# EAGLE board PX4FMUlite_V0_4 (EAGLE 6.5.0)
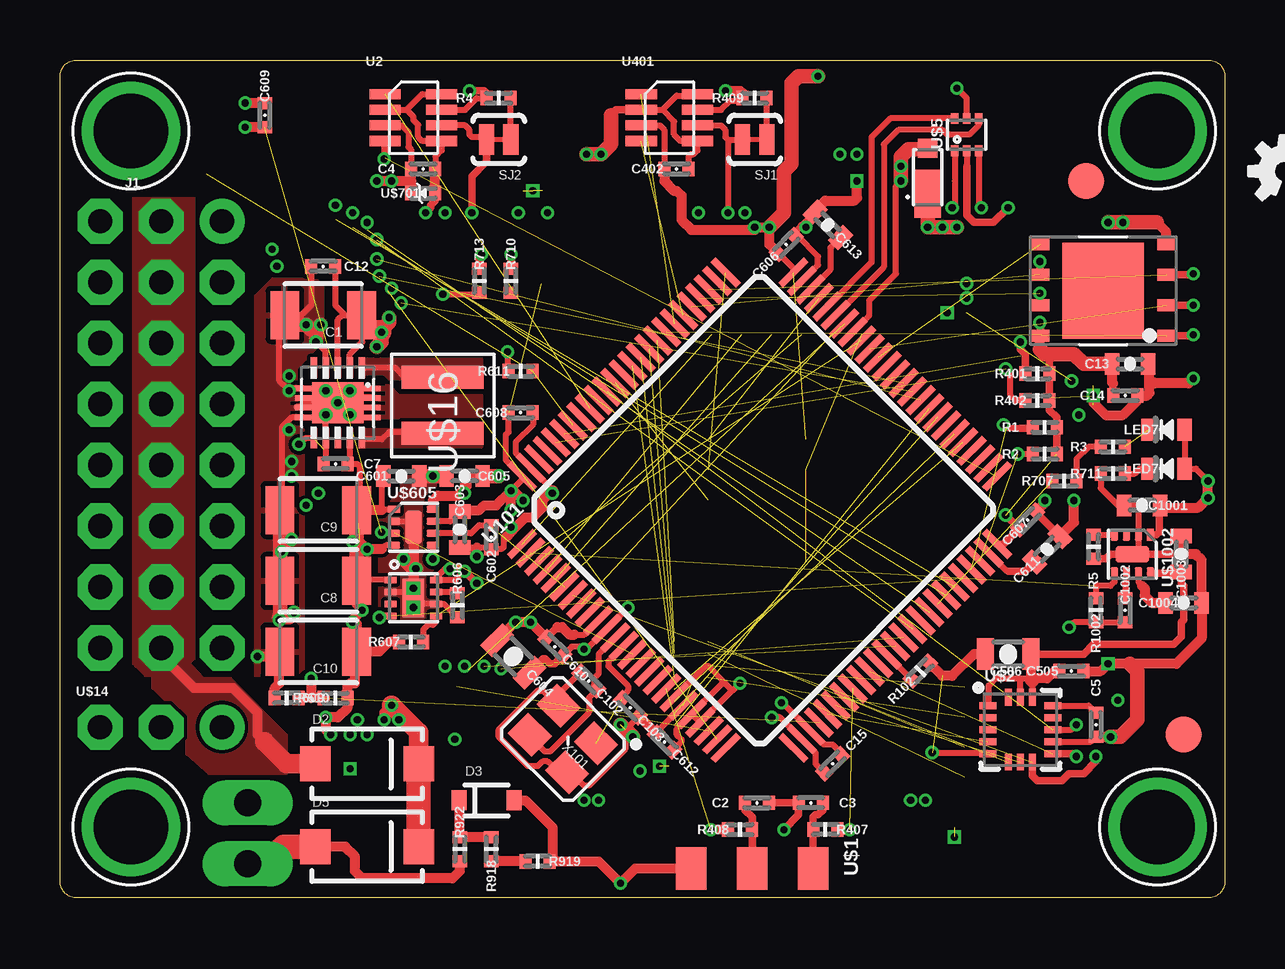
[diagram p12: board, top side]
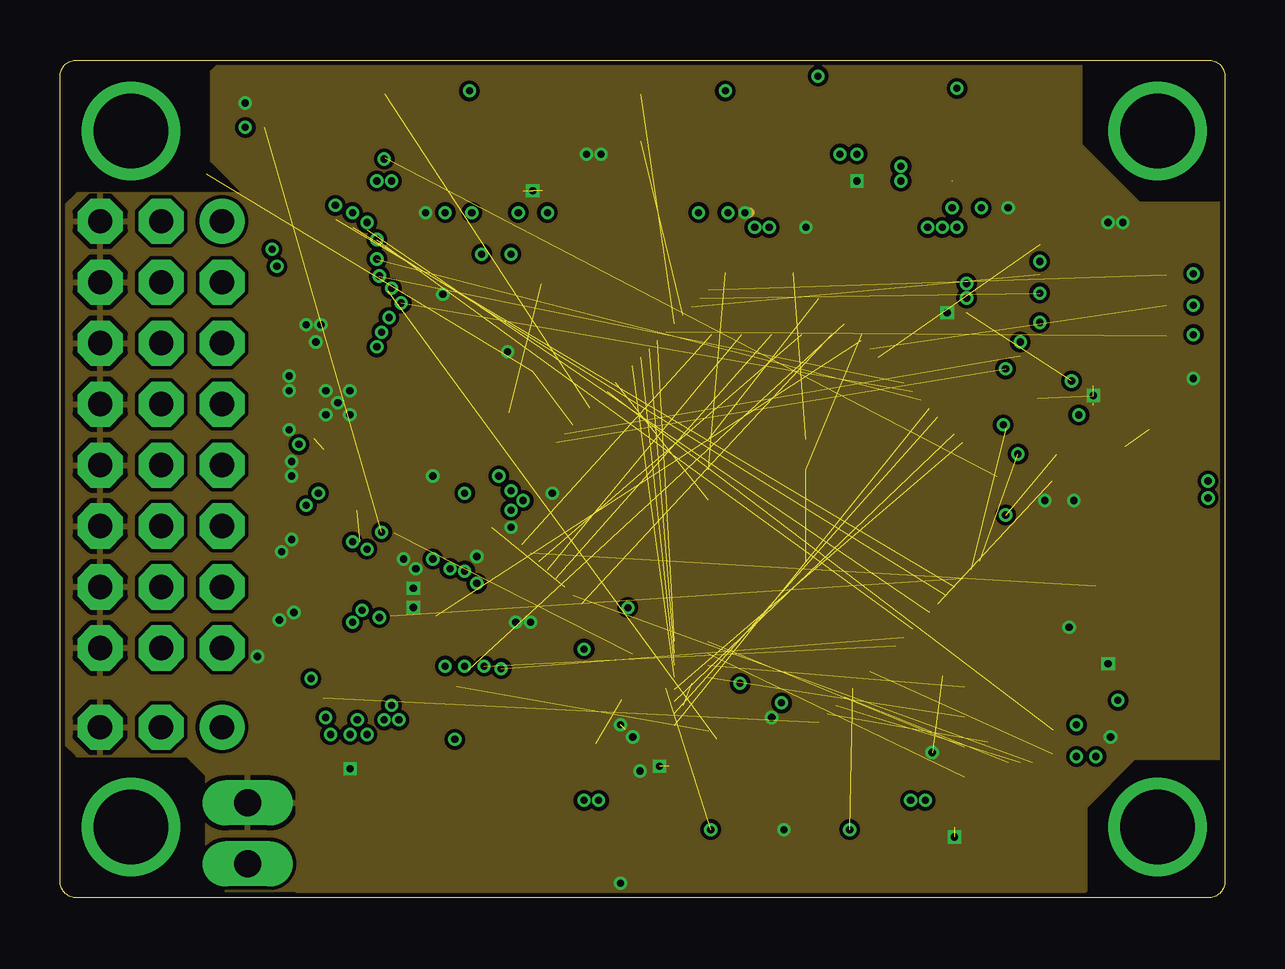
[diagram p13: board, inner layer Ground]
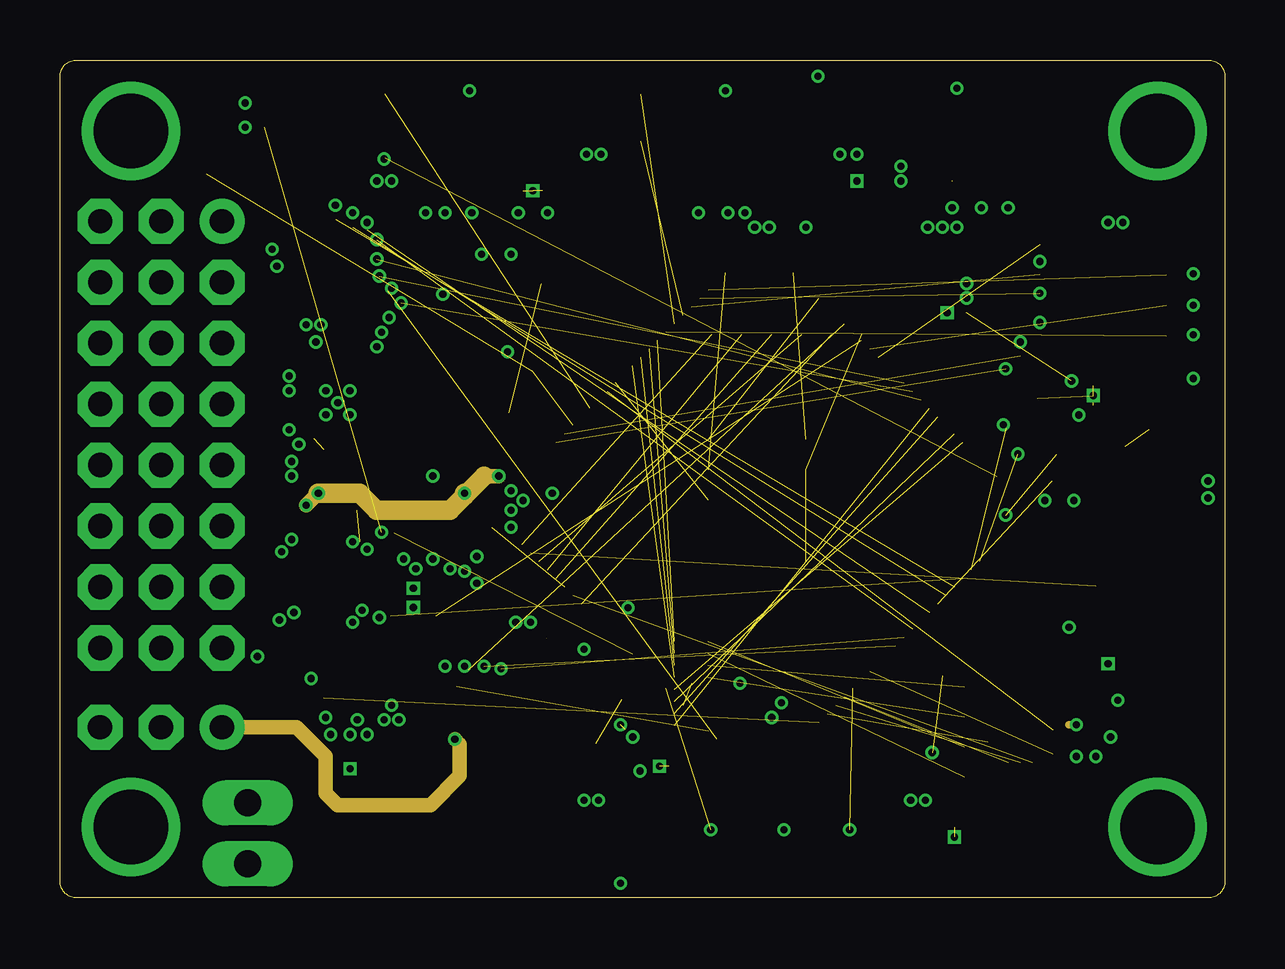
[diagram p14: board, inner layer Horizontal]
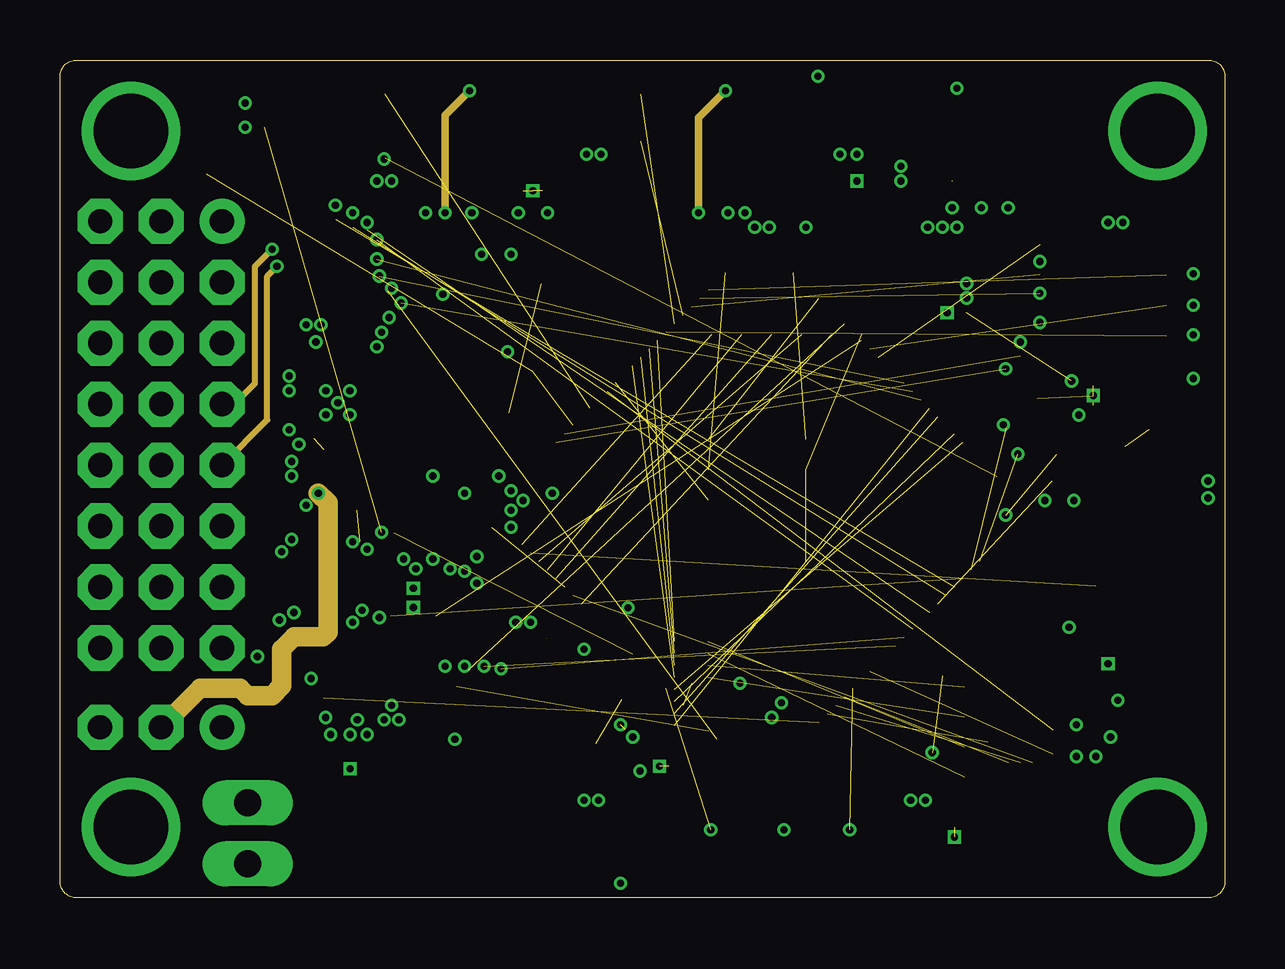
[diagram p15: board, inner layer Vertical]
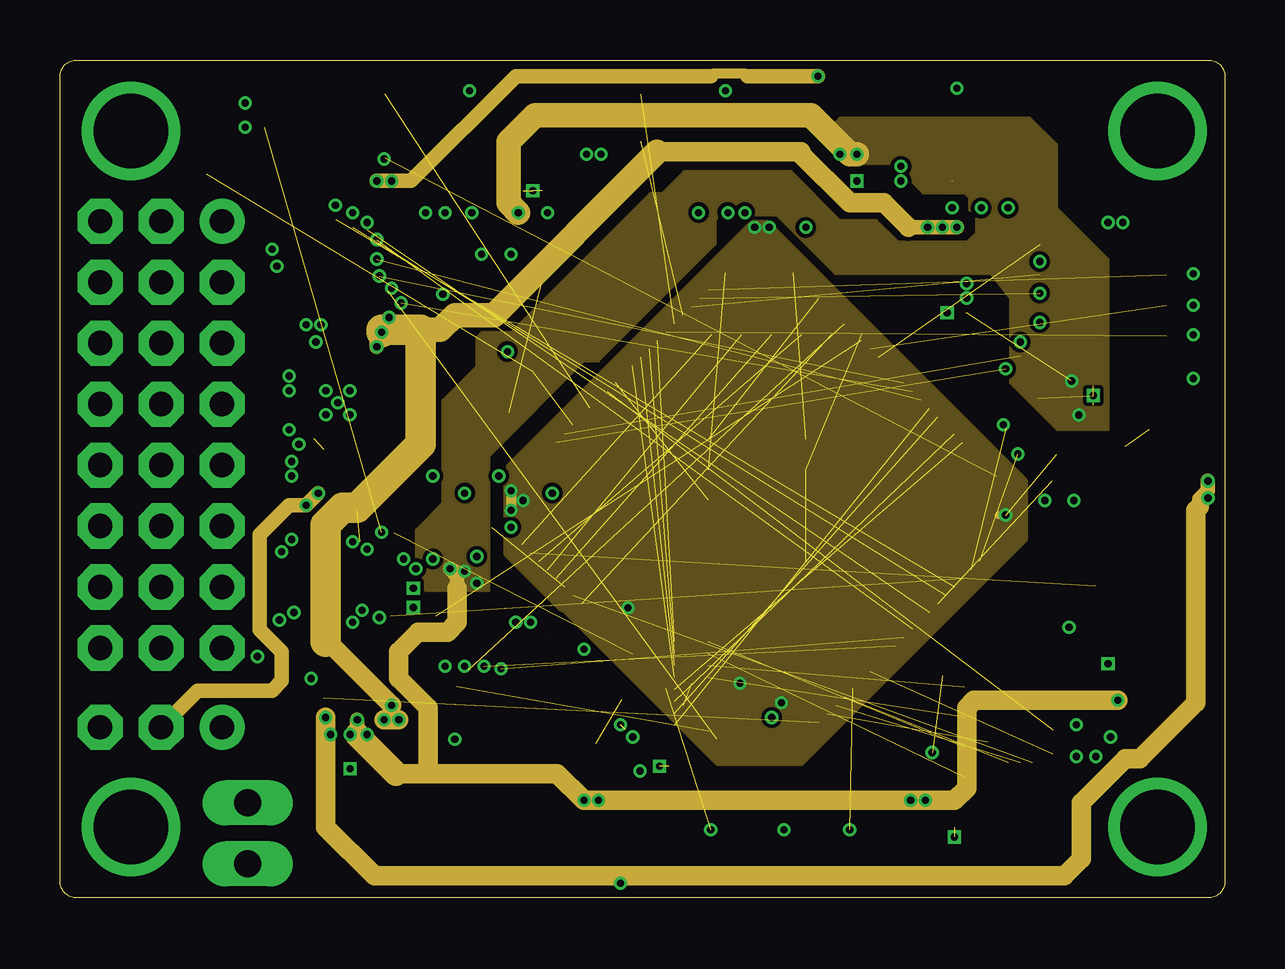
[diagram p16: board, inner layer Power]
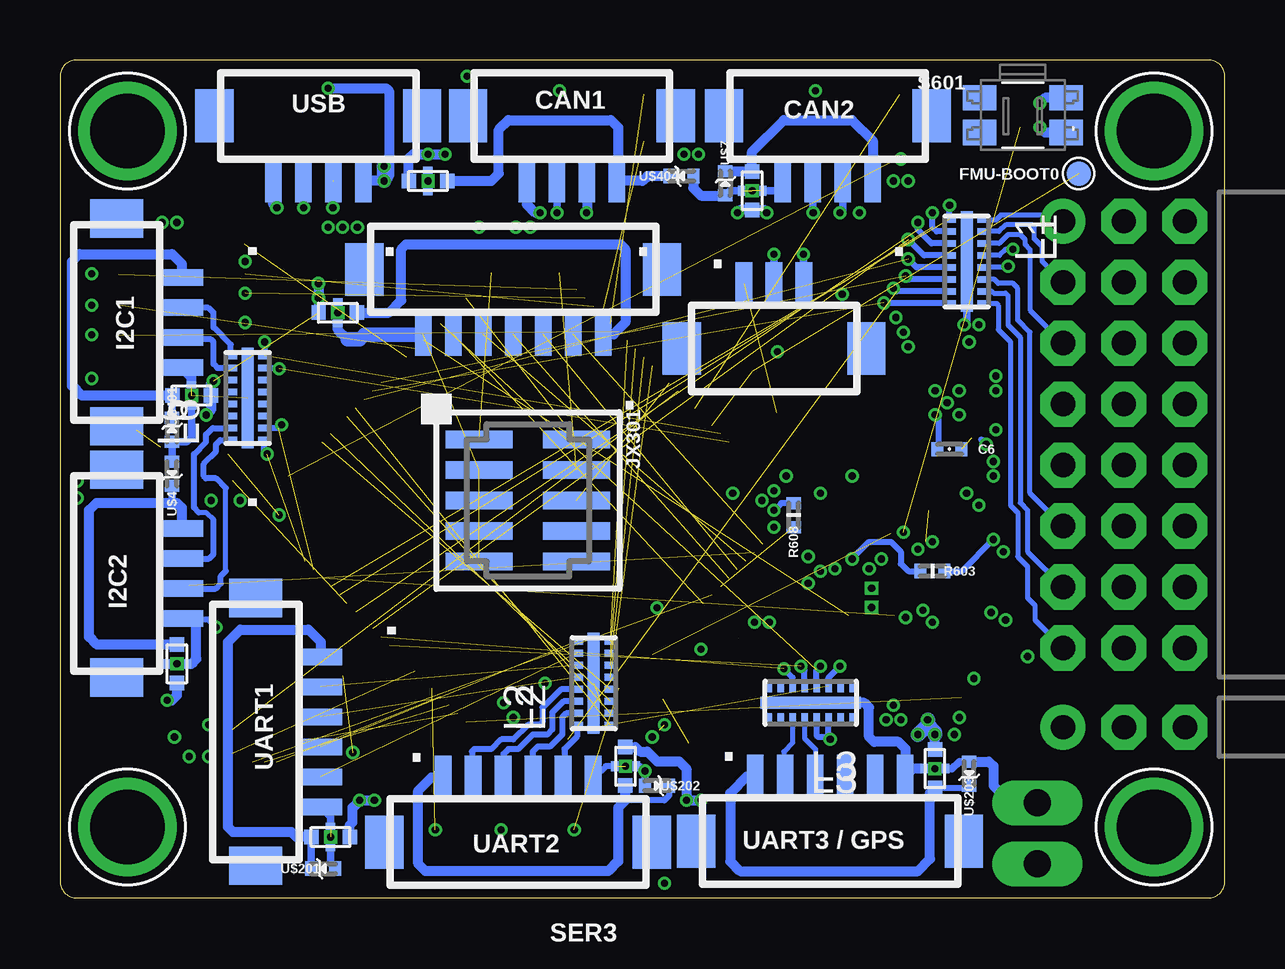
[diagram p17: board, bottom side, seen from below]

Size 48.56 x 34.91 mm. Coordinates in mm from the lower left corner, seen from the top.
Outline: 0,0.7 0,34.21 arc-90 0.7,34.91 47.86,34.91 arc-90 48.56,34.21 48.56,0.7 arc-90 47.86,0 0.7,0 arc-90 0,0.7
Copper layers (1*2*3*14*15*16): Top 0.035mm / dielectric 0.5mm / Ground 0.035mm / dielectric 0.15mm / Horizontal 0.035mm / dielectric 0.15mm / Vertical 0.035mm / dielectric 0.15mm / Power 0.035mm / dielectric 0.5mm / Bottom 0.035mm
Design rules "default *": minimum track width 0.2mm, minimum drill 0.3mm, track to track 0.15mm, track to pad 0.15mm, pad to pad 0.15mm, via to via 0.15mm, smd to smd 0.15mm, copper to edge 0.2mm, drill to drill 0.3mm, minimum pad ring 0.125mm, minimum via ring 0.125mm, stop-mask expansion 1mil, vias tented up to drill 0.31mm, thermal gap 8mil
Net classes: 0 signal: width 0.152 mm, drill 0.2 mm, clearance 0.152 mm; 1 power: width 0.254 mm, drill 0.3 mm, clearance 0.152 mm

## Footprints (pad centres in the part's own frame; a part is rotated, then mirrored left to right if it is on the bottom)
1210 = smd 1.2 x 2: 1 -1.6,0; 2 1.6,0
0402-CAP = smd 0.5 x 0.6: P$1 -0.5,0; P$2 0.5,0
0603-CAP = smd 0.6 x 0.9: P$1 -0.75,0; P$2 0.75,0
0805-CAP = smd 0.7 x 1.3: P$1 -0.95,0; P$2 0.95,0
MICROSMP = smd 0.8 x 0.8: ANODE 0.65,0 | smd 2 x 1.1: CATHODE -1.25,0
SMA-DIODE = smd 1.27 x 1.47: A -2.15,0; C 2.15,0
SOD-323 = smd 0.63 x 0.83: 1 -1.15,0; 2 1.15,0
PAD.04X.04 = smd 1.016 x 1.016: P$1 0,0
3X8RA_SERVO = drill 1.016 pad 1.88 octagon: GND_S1 -3.81,8.89; GND_S2 -3.81,6.35; GND_S3 -3.81,3.81; GND_S4 -3.81,1.27; GND_S5 -3.81,-1.27; GND_S6 -3.81,-3.81; GND_S7 -3.81,-6.35; GND_S8 -3.81,-8.89; PWR_S1 -1.27,8.89; PWR_S2 -1.27,6.35; PWR_S3 -1.27,3.81; PWR_S4 -1.27,1.27; PWR_S5 -1.27,-1.27; PWR_S6 -1.27,-3.81; PWR_S7 -1.27,-6.35; PWR_S8 -1.27,-8.89; S2 1.27,6.35; S3 1.27,3.81; S4 1.27,1.27; S5 1.27,-1.27; S6 1.27,-3.81; S7 1.27,-6.35; S8 1.27,-8.89 | drill 1.016 pad 1.88: S1 1.27,8.89
DF13C-4P-1.25V = smd 1.6 x 2.2: M$0 4.325,-1.8; M$1 -4.325,-1.8 | smd 0.7 x 1.8: P$1 -1.875,0.9; P$2 -0.625,0.9; P$3 0.625,0.9; P$4 1.875,0.9
DF13C-6P-1.25V = smd 1.6 x 2.2: M$0 5.575,-1.8; M$1 -5.575,-1.8 | smd 0.7 x 1.8: P$1 -3.125,0.9; P$2 -1.875,0.9; P$3 -0.625,0.9; P$4 0.625,0.9; P$5 1.875,0.9; P$6 3.125,0.9
DF13C-7P-1.25V = smd 1.6 x 2.2: M$0 6.2,-1.8; M$1 -6.2,-1.8 | smd 0.7 x 1.8: P$1 -3.75,0.9; P$2 -2.5,0.9; P$3 -1.25,0.9; P$4 0,0.9; P$5 1.25,0.9; P$6 2.5,0.9; P$7 3.75,0.9
DF13C-3P-1.25V = smd 1.6 x 2.2: M$0 3.85,-1.8; M$1 -3.85,-1.8 | smd 0.7 x 1.8: P$1 -1.25,0.9; P$2 0,0.9; P$3 1.25,0.9
FIDUCIAL-1.5X3 = smd 1.5 x 1.5: 1 0,0
1X02_LONGPADS = drill 1.118 pad 1.88 long: 1 0,0; 2 2.54,0
FTSH-105-01-XXX-DV-K = smd 0.737 x 2.794: 1 -2.54,-2.032; 2 -2.54,2.032; 3 -1.27,-2.032; 4 -1.27,2.032; 5 0,-2.032; 6 0,2.032; 7 1.27,-2.032; 8 1.27,2.032; 9 2.54,-2.032; 10 2.54,2.032
DFN16-THIN = smd 0.28 x 0.51: P$1 -1.75,-0.7; P$2 -1.25,-0.7; P$3 -0.75,-0.7; P$4 -0.25,-0.7; P$5 0.25,-0.7; P$6 0.75,-0.7; P$7 1.25,-0.7; P$8 1.75,-0.7; P$9 1.75,0.7; P$10 1.25,0.7; P$11 0.75,0.7; P$12 0.25,0.7; P$13 -0.25,0.7; P$14 -0.75,0.7; P$15 -1.25,0.7; P$16 -1.75,0.7 | smd 4.2 x 0.5: P$EP 0,0
KYOCERA-KNH16-DA = smd 0.6 x 0.6: P$1 -0.8,0; P$2 0.8,0 | smd 0.4 x 0.4: P$3 0,-0.4; P$4 0,0.4 | drill 0.3 pad 0.4 square: P$5 0,0
0603-LED = smd 0.6 x 0.9: A 0.75,0; C -0.75,0
MOUNT-HOLE3.1 = drill 3.1 pad 4.1: P$1 0,0
0402-RES = smd 0.5 x 0.6: P$1 -0.5,0; P$2 0.5,0
EVQP7J01K = smd 1.4 x 1.05: A1 -1.8,0.725; A2 1.8,0.725; B3 -1.8,-0.725; B4 1.8,-0.725
SJ_2S-TRACE = smd 0.635 x 1.27: 1 -0.508,0; 2 0.508,0
SOT23-8 = smd 0.42 x 1.3: 1 -0.975,-1.175; 2 -0.325,-1.175; 3 0.325,-1.175; 4 0.975,-1.175; 5 0.975,1.175; 6 0.325,1.175; 7 -0.325,1.175; 8 -0.975,1.175
TQFP100 = smd 1.5 x 0.29: 1 -8,6; 2 -8,5.5; 3 -8,5; 4 -8,4.5; 5 -8,4; 6 -8,3.5; 7 -8,3; 8 -8,2.5; 9 -8,2; 10 -8,1.5; 11 -8,1; 12 -8,0.5; 13 -8,0; 14 -8,-0.5; 15 -8,-1; 16 -8,-1.5; 17 -8,-2; 18 -8,-2.5; 19 -8,-3; 20 -8,-3.5; 21 -8,-4; 22 -8,-4.5; 23 -8,-5; 24 -8,-5.5; 25 -8,-6; 51 8,-6; 52 8,-5.5; 53 8,-5; 54 8,-4.5; 55 8,-4; 56 8,-3.5; 57 8,-3; 58 8,-2.5; 59 8,-2; 60 8,-1.5; 61 8,-1; 62 8,-0.5; 63 8,0; 64 8,0.5; 65 8,1; 66 8,1.5; 67 8,2; 68 8,2.5; 69 8,3; 70 8,3.5; 71 8,4; 72 8,4.5; 73 8,5; 74 8,5.5; 75 8,6 | smd 0.29 x 1.5: 26 -6,-8; 27 -5.5,-8; 28 -5,-8; 29 -4.5,-8; 30 -4,-8; 31 -3.5,-8; 32 -3,-8; 33 -2.5,-8; 34 -2,-8; 35 -1.5,-8; 36 -1,-8; 37 -0.5,-8; 38 0,-8; 39 0.5,-8; 40 1,-8; 41 1.5,-8; 42 2,-8; 43 2.5,-8; 44 3,-8; 45 3.5,-8; 46 4,-8; 47 4.5,-8; 48 5,-8; 49 5.5,-8; 50 6,-8; 76 6,8; 77 5.5,8; 78 5,8; 79 4.5,8; 80 4,8; 81 3.5,8; 82 3,8; 83 2.5,8; 84 2,8; 85 1.5,8; 86 1,8; 87 0.5,8; 88 0,8; 89 -0.5,8; 90 -1,8; 91 -1.5,8; 92 -2,8; 93 -2.5,8; 94 -3,8; 95 -3.5,8; 96 -4,8; 97 -4.5,8; 98 -5,8; 99 -5.5,8; 100 -6,8
HEADER_3X01_SMD_H_BOARD_EDGE_SHORT = smd 1.27 x 1.778: 1 -2.54,0; 2 0,0; 3 2.54,0
16LGA-3X3 = smd 0.7 x 0.3: 1 -1.35,1; 2 -1.35,0.5; 3 -1.35,0; 4 -1.35,-0.5; 5 -1.35,-1; 9 1.35,-1; 10 1.35,-0.5; 11 1.35,0; 12 1.35,0.5; 13 1.35,1 | smd 0.3 x 0.7: 6 -0.5,-1.35; 7 0,-1.35; 8 0.5,-1.35; 14 0.5,1.35; 15 0,1.35; 16 -0.5,1.35
WSON-8-5X6 = smd 0.5 x 0.75: 1 -1.875,-2.625; 2 -0.605,-2.625; 3 0.665,-2.625; 4 1.935,-2.625; 5 1.935,2.625; 6 0.665,2.625; 7 -0.605,2.625; 8 -1.875,2.625 | smd 4 x 3.4: PAD 0,0
0402-TVS = smd 0.5 x 0.6: A 0.5,0; C -0.5,0
SOT563-6 = smd 0.3 x 0.45: 1 -0.5,-0.675; 2 0,-0.675; 3 0.5,-0.675; 4 0.5,0.675; 5 0,0.675; 6 -0.5,0.675
3X1RA = drill 1.016 pad 1.88: 1 5.08,0 | drill 1.016 pad 1.88 octagon: 2 2.54,0; 3 0,0
PWSON10 = smd 0.28 x 0.85: 1 -1,-1.475; 2 -0.5,-1.475; 3 0,-1.475; 4 0.5,-1.475; 5 1,-1.475; 10 1,1.475; 11 0.5,1.475; 12 0,1.475; 13 -0.5,1.475; 14 -1,1.475 | smd 0.7 x 0.23: 6 1.425,-0.6; 7 1.425,-0.2; 8 1.425,0.2; 9 1.425,0.6; 15 -1.425,0.6; 16 -1.425,0.2; 17 -1.425,-0.2; 18 -1.425,-0.6 | drill 0.3 pad 0.406: 19 0.5,0.5; 20 0.5,-0.5; 21 -0.5,-0.5; 22 -0.5,0.5; 23 0,0 | smd 2.15 x 1.7: EP 0,0
XFL4020 = smd 0.965 x 3.404: 1 -1.168,0; 2 1.168,0
QFN8-DSG = smd 0.28 x 0.5: 1 -0.75,-0.95; 2 -0.25,-0.95; 3 0.25,-0.95; 4 0.75,-0.95; 5 0.75,0.95; 6 0.25,0.95; 7 -0.25,0.95; 8 -0.75,0.95 | smd 1.6 x 0.9: GND 0,0 | drill 0.3 square: P$2 -0.4,0; P$3 0.4,0
MLF-8-EPAD = smd 0.5 x 0.3: 1 -0.8,0.75; 2 -0.8,0.25; 3 -0.8,-0.25; 4 -0.8,-0.75; 5 0.8,-0.75; 6 0.8,-0.25; 7 0.8,0.25; 8 0.8,0.75 | smd 0.7 x 1.4: GND 0,0
OSCILLATOR-3.2X2.5 = smd 1.4 x 1.2: 1 -1.1,-0.85; 2 1.1,-0.85; 3 1.1,0.85; 4 -1.1,0.85

## Placement (x,y rotation side)
C1  22uF  [1210]  10.97,24.28 180 top
C2  0u1  [0402-CAP]  29.06,3.96 0 top
C3  0u1  [0402-CAP]  31.29,3.96 180 top
C4  0u1  [0402-CAP]  15.14,30.38 0 top
C5  0u1  [0402-CAP]  43.18,7.21 270 top
C6  0u1  [0402-CAP]  11.48,18.69 180 bottom
C7  0u1  [0402-CAP]  11.48,18.08 180 top
C8  22uF  [1210]  10.77,13.21 180 top
C9  22uF  [1210]  10.77,16.15 180 top
C10  22uF  [1210]  10.77,10.26 180 top
C12  0u1  [0402-CAP]  10.97,26.31 180 top
C13  2u2  [0603-CAP]  44.6,22.25 0 top
C14  0u1  [0402-CAP]  44.4,20.93 0 top
C15  0u1  [0402-CAP]  32.21,5.59 225 top
C102  8p  [0402-CAP]  22.05,9.04 135 top
C103  8p  [0402-CAP]  23.77,7.92 135 top
C402  0u1  [0402-CAP]  25.7,30.38 0 top
C505  10n  [0402-CAP]  42.16,9.45 0 top
C506  10u/10V  [0805-CAP]  39.52,10.16 180 top
C601  2u2  [0603-CAP]  14.22,17.58 0 top
C602  10n  [0402-CAP]  17.98,15.04 90 top
C603  1u0  [0603-CAP]  16.66,15.34 270 top
C604  10u/10V  [0805-CAP]  18.9,10.06 135 top
C605  1u0  [0603-CAP]  16.87,17.58 180 top
C606  0u1  [0402-CAP]  30.28,27.23 45 top
C607  0u1  [0402-CAP]  40.34,15.75 45 top
C608  0u1  [0402-CAP]  19.2,20.22 0 top
C609  0u1  [0402-CAP]  8.53,32.61 270 top
C610  0u1  [0402-CAP]  20.62,10.46 135 top
C611  2u2  [0603-CAP]  41.15,14.53 45 top
C612  0u1  [0402-CAP]  25.2,6.5 135 top
C613  2u2  [0603-CAP]  32,28.04 135 top
C1001  1u0  [0603-CAP]  45.11,16.36 180 top
C1002  10n  [0402-CAP]  44.4,11.99 270 top
C1003  1u0  [0603-CAP]  46.74,14.33 90 top
C1004  1u0  [0603-CAP]  46.84,12.29 0 top
D1  MSS1P4-M3  [MICROSMP]  36.17,30.58 90 top
D2  B340A  [SMA-DIODE]  12.8,5.59 0 top
D3  [SOD-323]  17.78,4.06 0 top
D5  B340A  [SMA-DIODE]  12.8,2.13 0 top
FMU-BOOT0  PAD.04  [PAD.04X.04]  6.1,30.18 0 bottom
J1  [3X8RA_SERVO]  5.49,19.3 0 top
J2  DF13-4P-1.25V  [DF13C-4P-1.25V]  44.4,13.51 270 bottom
J3  DF13C-4P-1.25V  [DF13C-4P-1.25V]  16.56,30.78 180 bottom
J201  DF13C-6P-1.25V  [DF13C-6P-1.25V]  38.6,6.92 270 bottom
J202  DF13C-6P-1.25V  [DF13C-6P-1.25V]  29.47,4.12 0 bottom
J203  DF13C-6P-1.25V  [DF13C-6P-1.25V]  16.46,4.17 0 bottom
J302  DF13C-4P-1.25V  [DF13C-4P-1.25V]  37.8,30.78 180 bottom
J401  DF13C-4P-1.25V  [DF13C-4P-1.25V]  44.4,23.98 270 bottom
J403  DF13C-7P-1.25V  [DF13C-7P-1.25V]  29.67,24.38 180 bottom
J405  DF13C-4P-1.25V  [DF13C-4P-1.25V]  27.23,30.78 180 bottom
J802  DF13C-3P-1.25V  [DF13C-3P-1.25V]  18.8,24.69 0 bottom
JP1  FIDUCIAL1.5X3  [FIDUCIAL-1.5X3]  42.77,29.87 0 top
JP2  FIDUCIAL1.5X3  [FIDUCIAL-1.5X3]  46.84,6.81 0 top
JP5  M02PTH3  [1X02_LONGPADS]  7.82,1.42 90 top
JX301  ARM_MINI_JTAG-SMT  [FTSH-105-01-XXX-DV-K]  29.06,16.56 270 bottom
L1  NUF8402MN  [DFN16-THIN]  10.77,26.52 270 bottom
L2  NUF8402MN  [DFN16-THIN]  26.31,8.94 90 bottom
L3  NUF8402MN  [DFN16-THIN]  17.27,8.13 180 bottom
L4  KNH16C104DA5TS  [KYOCERA-KNH16-DA]  43.08,20.93 180 bottom
L5  KNH16C104DA5TS  [KYOCERA-KNH16-DA]  43.69,9.75 90 bottom
L6  NUF8402MN  [DFN16-THIN]  40.74,20.83 90 bottom
L7  KNH16C104DA5TS  [KYOCERA-KNH16-DA]  19.71,29.46 90 bottom
L201  KNH16C104DA5TS  [KYOCERA-KNH16-DA]  37.29,2.54 180 bottom
L202  KNH16C104DA5TS  [KYOCERA-KNH16-DA]  24.99,5.49 270 bottom
L203  KNH16C104DA5TS  [KYOCERA-KNH16-DA]  12.09,5.38 270 bottom
L402  KNH16C104DA5TS  [KYOCERA-KNH16-DA]  36.98,24.38 0 bottom
L403  KNH16C104DA5TS  [KYOCERA-KNH16-DA]  33.22,29.87 0 bottom
LED701  AMBER  [0603-LED]  46.13,19.51 0 top
LED704  GREEN  [0603-LED]  46.13,17.88 0 top
M3_MOUNT1101  MOUNT-HOLE3.1MM  [MOUNT-HOLE3.1]  2.95,31.96 0 top
M3_MOUNT1102  MOUNT-HOLE3.1MM  [MOUNT-HOLE3.1]  45.75,2.96 0 top
M3_MOUNT1103  MOUNT-HOLE3.1MM  [MOUNT-HOLE3.1]  45.75,31.96 0 top
M3_MOUNT1104  MOUNT-HOLE3.1MM  [MOUNT-HOLE3.1]  2.95,2.96 0 top
OSHW_LOGO  OSHW-LOGOS  [OSHW-LOGO-S]  51.04,30.27 0 top
R1  1K5  [0402-RES]  41.05,19.61 0 top
R2  1K5  [0402-RES]  41.05,18.49 0 top
R3  220R  [0402-RES]  43.89,18.8 0 top
R4  120R  [0402-RES]  18.29,33.32 0 top
R5  10K  [0402-RES]  43.08,14.63 90 top
R102  10K  [0402-RES]  35.86,9.45 45 top
R401  1K5  [0402-RES]  40.74,21.84 0 top
R402  1K5  [0402-RES]  40.74,20.73 0 top
R407  10K/0.1%  [0402-RES]  31.9,2.84 180 top
R408  10K/0.1%  [0402-RES]  28.35,2.84 0 top
R409  120R  [0402-RES]  28.96,33.32 0 top
R603  10K  [0402-RES]  12.19,13.61 180 bottom
R606  25K  [0402-RES]  16.56,12.19 270 top
R607  10K  [0402-RES]  14.63,10.67 0 top
R608  1K  [0402-RES]  17.98,15.95 90 bottom
R609  10K/0.1%  [0402-RES]  11.48,8.33 0 top
R610  10K/0.1%  [0402-RES]  9.45,8.33 180 top
R611  10K  [0402-RES]  19.2,21.95 0 top
R707  220R  [0402-RES]  41.86,17.37 0 top
R710  47R  [0402-RES]  18.8,25.7 270 top
R711  220R  [0402-RES]  43.89,17.68 0 top
R713  1K5  [0402-RES]  17.48,25.7 270 top
R918  10K/0.1%  [0402-RES]  17.98,2.03 90 top
R919  10K/0.1%  [0402-RES]  19.91,1.52 180 top
R922  10K/0.1%  [0402-RES]  16.66,2.03 270 top
R1002  10K  [0402-RES]  43.18,11.99 90 top
S601  RESET  [EVQP7J01K]  8.43,32.61 180 bottom
SJ1  SOLDERJUMPERTRACE  [SJ_2S-TRACE]  28.96,31.6 180 top
SJ2  SOLDERJUMPERTRACE  [SJ_2S-TRACE]  18.29,31.6 180 top
U2  MAX3051  [SOT23-8]  14.73,32.51 270 top
U101  STM32F4X7VX  [TQFP100]  29.16,16.15 45 top
U401  MAX3051  [SOT23-8]  25.4,32.51 270 top
U$1  HEADER-3X1BOARDEDGE-SHORT  [HEADER_3X01_SMD_H_BOARD_EDGE_SHORT]  28.85,1.22 180 top
U$2  MAX21100  [16LGA-3X3]  40.03,7.01 0 top
U$3  W25Q64FV  [WSON-8-5X6]  43.48,25.3 90 top
U$4  PESD0402-140  [0402-TVS]  43.89,17.68 90 bottom
U$5  NUF2042XV6  [SOT563-6]  37.8,31.8 0 top
U$7  PESD0402-140  [0402-TVS]  20.83,29.77 270 bottom
U$14  HEADER-3X1RA  [3X1RA]  1.67,7.11 0 top
U$15  TPS6303X  [PWSON10]  11.58,20.62 180 top
U$16  XFL4020-222MEB  [XFL4020]  15.95,20.52 90 top
U$201  PESD0402-140  [0402-TVS]  37.59,1.22 0 bottom
U$202  PESD0402-140  [0402-TVS]  23.67,4.67 180 bottom
U$203  PESD0402-140  [0402-TVS]  10.67,5.18 90 bottom
U$401  PESD0402-140  [0402-TVS]  43.89,19.51 270 bottom
U$404  PESD0402-140  [0402-TVS]  22.66,30.07 0 bottom
U$604  BQ24315  [QFN8-DSG]  14.73,12.5 270 top
U$605  MIC5332  [MLF-8-EPAD]  14.73,15.44 0 top
U$701  PESD0402-140  [0402-TVS]  15.14,29.36 0 top
U$1002  MIC5332  [MLF-8-EPAD]  44.7,14.33 270 top
X101  3.2x2.5 mm / 24 MHz / 15 ppm  [OSCILLATOR-3.2X2.5]  20.96,6.62 135 top

## Tracks (layer width: path | path; a pad name or v marks a point on that pad's centre or on a via)
5V_S1_FILTERED
  Bottom 0.305: U$201.C L201.P$2
  Bottom 0.406: L201.P$2 38.71,2.54 38.91,2.74 41.35,2.74 41.55,2.95 41.55,10.67 41.05,11.18 38.2,11.18 37.69,10.67 J201.P$1
5V_S2_FILTERED
  Bottom 0.254: U$202.C 23.17,4.26 23.37,4.06 24.99,4.06
  Bottom 0.406: J202.P$1 33.08,5.02 33.63,4.47 33.63,1.42 33.32,1.12 25.7,1.12 25.3,1.52 25.3,3.76 24.99,4.06 L202.P$2
5V_S3_FILTERED
  Bottom 0.254: L203.P$2 10.76,4.58 U$203.C
  Bottom 0.406: J203.P$1 19.93,5.07 20.62,4.37 20.62,1.52 20.22,1.12 12.8,1.12 12.29,1.63 12.29,4.38 L203.P$2
!FMU-LED_AMBER  (1 unrouted)
!GYRO_CS  (via drill 0.3)  (1 unrouted)
  Top 0.305: U$2.8 40.53,5.09 40.74,4.88 41.76,4.88 42.06,5.18 42.67,5.18 43.18,5.69 v43.18,5.89
!SPI_EXT_NSS  (1 unrouted)
!VDD_5V_PERIPH_EN  (1 unrouted)
  Top 0.254: U$604.5 15.68,11.52 15.54,11.38 15.34,11.38 15.14,11.18 R607.P$2
!VDD_5V_PERIPH_OC  (via drill 0.3)  (1 unrouted)
  Top 0.254: U$604.4 13.37,11.75 v13.31,11.68
ACCEL_DRDY  (via drill 0.3)  (1 unrouted)
  Top 0.254: U$2.11 42.16,7.01 v42.37,7.21
  Horizontal 0.305: v42.37,7.21 42.06,7.21
CAN1_H  (via drill 0.3)
  Top 0.254: U401.7 27.55,32.84 27.94,33.22 28.35,33.22 R409.P$1
  Top 0.305: 28.45,33.53 R409.P$1
  Top 0.406: v27.74,33.63 28.35,33.63 28.45,33.53
  Vertical 0.305: v26.62,28.55 26.62,32.51 v27.74,33.63
  Bottom 0.406: J405.P$2 26.6,28.56 v26.62,28.55
CAN1_L  (via drill 0.3)
  Top 0.254: U401.6 27.55,32.19 27.74,32 27.74,31.7 27.84,31.6 | 27.84,31.6 SJ1.2 | 27.84,31.6 v27.84,28.55
  Bottom 0.305: v27.84,28.55 27.84,29.87 J405.P$3
CAN1_RX  (1 unrouted)
CAN1_TX  (1 unrouted)
CAN2_H  (via drill 0.3)
  Top 0.254: U2.7 16.89,32.84 17.37,33.32 R4.P$1
  Top 0.305: v17.07,33.63 17.68,33.63 17.78,33.53 R4.P$1
  Vertical 0.305: v16.05,28.55 16.05,32.61 v17.07,33.63
  Bottom 0.305: J3.P$2 15.94,28.67 v16.05,28.55
CAN2_L  (via drill 0.3)
  Top 0.254: SJ2.2 17.68,31.7 17.17,31.7 17.07,31.8 17.07,32 16.89,32.19 U2.6
  Top 0.305: v17.17,28.55 17.17,30.07 17.78,30.68 SJ2.2
  Bottom 0.305: J3.P$3 17.19,28.56 v17.17,28.55
CAN2_RX  (via drill 0.3)  (1 unrouted)
  Top 0.305: v13.51,30.78 13.56,30.83 U2.4
  Top 0.406: U2.4 13.51,31.54
CAN2_TX  (1 unrouted)
FMU-!RESET  (via drill 0.3)  (2 unrouted)
  Top 0.254: U$605.3 13.46,15.19 v13.41,15.24
  Top 0.406: C609.P$2 v7.73,32.11 v7.72,32.11
  Bottom 0.406: S601.A1 7.5,31.89 v7.72,32.11
FMU-BOOT0  (2 unrouted)
FMU-CH1  (via drill 0.3)  (1 unrouted)
  Bottom 0.254: L1.P$1 v11.48,28.85
FMU-CH1-PROT
  Bottom 0.2: J1.S1 7.01,28.45 9.35,28.45 9.55,28.24 10.05,28.24 L1.P$16
FMU-CH2  (via drill 0.3)  (1 unrouted)
  Bottom 0.254: L1.P$2 12.02,27.77 12.19,27.94 v12.19,28.55
FMU-CH3  (via drill 0.3)  (1 unrouted)
  Bottom 0.254: L1.P$3 12.23,27.27 12.8,27.84 v12.8,28.14
FMU-CH4  (via drill 0.3)  (1 unrouted)
  Bottom 0.254: L1.P$4 12.54,26.77 v13.21,27.43
FMU-CH5  (via drill 0.3)  (1 unrouted)
  Bottom 0.254: L1.P$5 12.86,26.27 v13.21,26.62
FMU-CH6  (via drill 0.3)  (1 unrouted)
  Bottom 0.254: L1.P$6 13.17,25.77 v13.31,25.91
FMU-CH7  (via drill 0.3)  (1 unrouted)
  Bottom 0.254: L1.P$7 13.69,25.27 v13.82,25.4
FMU-CH8  (via drill 0.3)  (1 unrouted)
  Bottom 0.254: L1.P$8 14.2,24.77 v14.22,24.79
FMU-I2C1_SCL  (via drill 0.3)  (1 unrouted)
  Top 0.305: R401.P$1 40.23,21.85 40.23,22.66 40.03,22.86 v40.03,23.16
  Bottom 0.254: v40.03,23.16 40.03,22.59 L6.P$8
FMU-I2C1_SDA  (via drill 0.3)  (1 unrouted)
  Top 0.254: R402.P$1 39.83,20.73 39.62,20.93 39.62,21.84 v39.42,22.05
  Bottom 0.254: v39.42,22.05 39.45,22.08 L6.P$7
FMU-I2C2_SCL  (via drill 0.3)  (1 unrouted)
  Top 0.254: L6.P$2 39.45,19.58 v39.32,19.71
  Top 0.305: R1.P$1 40.52,19.58 L6.P$2
  Bottom 0.254: v39.32,19.71 39.45,19.58 L6.P$2
FMU-I2C2_SDA  (via drill 0.3)  (1 unrouted)
  Top 0.254: R2.P$1 v39.93,18.49
  Bottom 0.254: v39.93,18.49 40.04,18.6 L6.P$1
FMU-SWCLK  (1 unrouted)
FMU-SWDIO  (1 unrouted)
FMU-SWO  (1 unrouted)
FMU-UART7_RX  (via drill 0.3)  (1 unrouted)
  Bottom 0.254: L3.P$5 17.52,9.5 v17.68,9.65
FMU-UART7_TX  (via drill 0.3)  (1 unrouted)
  Bottom 0.254: L3.P$6 18.02,9.18 v18.39,9.55
FMU-USART2_CTS  (1 unrouted)
FMU-USART2_RTS  (1 unrouted)
FMU-USART2_RX  (1 unrouted)
FMU-USART2_TX  (1 unrouted)
FMU-USART3_CTS  (1 unrouted)
FMU-USART3_RTS  (1 unrouted)
FMU-USART3_RX  (1 unrouted)
FMU-USART3_TX  (1 unrouted)
FMU-VDD_3V3  (via drill 0.3)  (3 unrouted)
  Top 0.254: U101.21 U101.22 28,8.64 28.04,8.64 | C612.P$1 25.91,6.51 25.91,6.6 25.7,6.81 25.7,7.04 U101.21 | U401.3 25.01,32.19 25.2,32 C402.P$1 | U2.3 14.24,32.19 14.53,31.9 14.53,31.29 14.63,31.19 C4.P$1 | U$605.7 16.26,15.69 C603.P$1 16.87,16.09 16.93,16.15 | v18.8,16.97 19.26,17.43 U101.100 18.59,18.24 18.59,19.3 18.7,19.41 C608.P$1 | U101.75 30.57,26.22 C606.P$1 | v23.67,12.09 v23.67,12.08 U101.11 21.95,10.36 v21.84,10.36 21.74,10.46 21.34,10.46 C610.P$1 | C15.P$1 32.56,6.05 32.21,6.4 31.84,6.4 U101.28 30.11,8.13 v30.07,8.13 | U101.21 27.64,8.97 27.7,8.97 | 27.7,8.97 28.04,8.64 | 27.7,8.97 27.03,9.65 26.9,9.65 U101.19 | 28.04,8.64 v28.35,8.94
  Top 0.305: U101.50 39.33,14.74 C607.P$1 v39.42,15.95 | C604.P$1 20.14,9.96 20.22,9.96 20.42,9.75 20.62,9.75 C610.P$1 | v40.84,23.98 40.86,23.96 U$3.8 | 43.89,21.44 43.89,20.94 C14.P$1 | 41.25,22.66 R401.P$2 R402.P$2 41.24,20.33 41.55,20.02 R1.P$2 R2.P$2
  Top 0.406: 16.93,16.15 17.48,16.15 17.68,16.36 18.19,16.36 v18.8,16.97 | v18.8,16.15 v18.8,16.97 | v19.3,16.56 18.9,16.97 v18.8,16.97 | C606.P$1 29.57,27.23 v29.57,27.94 v28.96,27.94 28.96,27.84 26.31,27.84 25.91,28.24 25.91,29.26 25.7,29.46 25.6,29.46 25.2,29.87 C402.P$1 | 40.84,22.86 40.84,23.41 U$3.8 | C13.P$1 43.85,21.48 43.89,21.44 | U$701.C 14.64,29.87 | 14.64,29.87 C4.P$1 | v13.21,29.87 v13.82,29.87 14.64,29.87
  Top 0.61: v29.57,27.94 30.18,28.55 30.18,30.28 30.48,30.58 30.48,33.93 30.78,34.24 v31.6,34.24 | C13.P$1 42.67,22.25 42.27,22.66 41.25,22.66 41.05,22.66 40.84,22.86
  Power 0.305: v39.42,15.95 39.12,15.95
  Power 0.406: v18.8,16.97 v18.8,16.15 | 28.65,34.24 28.55,34.34 27.23,34.34 27.13,34.24
  Power 0.61: v31.6,34.24 28.65,34.24 | 27.13,34.24 19.01,34.24 14.64,29.87 v13.82,29.87 v13.21,29.87
  Bottom 0.254: R608.P$2 18.5,16.45 v18.8,16.15
  pour Power: 18.59,14.33 18.59,17.88 28.85,28.14 29.46,28.14 40.23,17.37 40.23,14.94 31.6,6.3 30.89,5.59 27.43,5.59 21.03,11.99 20.93,11.99
FMU_AUX_ADC1  (via drill 0.3)  (1 unrouted)
  Top 0.406: R408.P$1 v27.13,2.84
FMU_AUX_ADC1_PROT
  Top 0.305: U$1.2 R408.P$2 28.85,3.35 28.56,3.65 C2.P$1
FMU_AUX_ADC2  (via drill 0.3)  (1 unrouted)
  Top 0.406: R407.P$1 v32.92,2.84
FMU_AUX_ADC2_PROT
  Top 0.305: U$1.1 R407.P$2 31.39,3.35 31.5,3.45 31.6,3.45 31.79,3.65 C3.P$1
GND  (via drill 0.3, 0.3 pad 0.3)  (14 unrouted)
  Top 0.254: U101.20 24.84,6.89 C612.P$2 | U401.2 25.12,32.84 | 25.12,32.84 25.7,33.43 26.51,33.43 U401.8 | 25.12,32.84 25.6,32.35 25.6,31.8 25.87,31.54 U401.5 26.58,31.15 26.42,30.99 26.31,30.99 26.21,30.89 C402.P$2 | C4.P$2 15.65,30.39 15.65,30.89 15.91,31.15 U2.5 15.1,31.54 14.94,31.7 14.94,32.21 14.73,32.41 14.73,32.55 14.45,32.84 | U2.2 14.45,32.84 | 14.45,32.84 15.1,33.49 U2.8 | U$15.6 9.46,21.22 9.14,21.54 9.14,24.05 C1.2 10.06,24.28 10.47,24.7 C12.P$2 | U$15.9 9.66,20.02 9.25,19.61 9.25,16.23 C9.2 | U$15.4 11.08,22.75 v10.67,23.16 | C103.P$1 23.57,7.01 23.57,6.2 22.05,4.67 21.84,4.67 21.28,5.24 X101.4 21.08,5.18 20.83,5.18 20.32,5.69 20.12,5.69 19.91,5.49 19.51,5.49 18.29,6.71 18.29,7.01 19.91,8.64 20.12,8.64 20.75,8 X101.2 20.78,8.49 C102.P$2 | U$605.2 14.73,15.69 U$605.GND | 16.73,14.53 C603.P$2 17.37,14.59 17.93,14.59 C602.P$1 18.4,14.54 18.49,14.63 18.49,14.93 18.59,15.04 | U101.74 31.6,26.37 31.6,26.72 30.74,27.58 C606.P$2 30.63,27.73 30.91,28.01 C613.P$2 | U$604.P$3 14.88,12.25 U$604.6 16.01,12.25 R606.P$2 | U$604.2 14.58,12.75 U$604.P$2 | U$2.10 42.98,6.51 C5.P$2 | C7.P$2 11.08,18.19 U$15.11 U$15.19 | U$5.2 37.8,30.48 | C608.P$2 19.71,19.71 19,19 19,18.54 U101.99 20.57,16.97 | 21.44,10.97 21.86,10.97 U101.10 | C15.P$2 31.5,5.59 31.5,6.04 U101.27 30.02,7.52 v29.67,7.52 | U$1002.GND 44.95,14.58 U$1002.2 44.95,16.31 44.91,16.36 C1001.P$2 44.09,16.36 43.38,17.07 43.38,17.67 R711.P$1 | C1002.P$2 R1002.P$1 42.88,11.49 42.88,11.48 42.27,11.48 v42.06,11.28 | U$15.8 9.85,20.46 10.05,20.46 10.25,20.66 11.45,20.66 11.65,20.86 12.95,20.86 U$15.17 | v18.65,22.76 18.65,21.96 R611.P$1
  Top 0.254: v15.95,25.16 17.45,25.16 R713.P$2 | v36.35,6.06 38.65,6.06 U$2.5
  Top 0.305: C607.P$2 40.69,16.05 C611.P$2 | 37.8,30.48 37.8,28.45 38.1,28.14 38.91,28.14 v39.52,28.75 | v31.09,27.94 31.02,28.01 30.91,28.01 | C610.P$2 20.73,11.28 | C1003.P$2 46.74,14.53 46.53,14.33 U$1002.GND 43.79,14.33 43.59,14.13 R5.P$1 | C2.P$2 C3.P$2 30.78,3.95 30.78,3.45 v30.18,2.84 | U401.2 23.19,32.84 22.96,32.61 | v15.24,28.55 15.44,28.75 15.44,28.85 15.64,29.05 U$701.A
  Top 0.406: C103.P$1 C612.P$2 | 18.59,15.04 18.85,15.29 | 18.85,15.29 19.41,15.85 19.71,15.85 20.12,16.26 20.12,16.56 20.52,16.97 | C604.P$2 18.98,11.48 v19,11.48 v19.61,11.48 C610.P$2 | C5.P$2 43.78,6.71 v43.79,6.71 | C607.P$2 41.05,16.46 v41.05,16.56 | C611.P$2 42.27,15.65 v42.27,16.56 | 9.14,10.29 C10.2 | v8.23,10.06 8.97,10.06 C10.2 | C506.P$2 38.1,10.16 37.19,9.25 36.78,9.25 R102.P$2 | v18.8,15.44 18.8,15.34 18.85,15.29 | v9.65,14.93 9.25,14.53 v9.25,14.43 | 20.73,11.28 20.93,11.28 21.23,10.97 21.44,10.97 | U$3.4 46.11,27.75 45.72,28.14 | 45.42,21.64 45.42,21.03 45.31,20.93 C14.P$2 44.9,20.72 44.3,20.12 43.59,20.12 43.08,20.62 L4.P$5 | 45.42,21.64 45.42,22.19 C13.P$2 | v47.24,21.64 47.04,21.44 45.62,21.44 45.42,21.64 | U$605.GND U$604.P$2 | U$604.P$2 U$604.P$3 | U$604.P$2 14.73,13.61 v14.83,13.72 | 46.74,14.53 46.94,14.33 47.35,14.33 47.59,14.08 C1004.P$2 47.59,10.81 46.53,9.75 44.6,9.75 L5.P$5 43.38,9.45 C505.P$2 | C613.P$2 31.47,28.63 31.9,29.06 33.12,29.06 33.22,29.16 L403.P$5 | v17.37,14.22 17.37,14.59 | R610.P$2 8.95,8.75 9.14,8.94 9.14,10.24 C10.2 | C610.P$2 | 20.57,16.97 20.52,16.97 | 20.52,16.97 v20.52,16.87 | U$701.A C4.P$2 | U$1.3 23.98,1.22 v23.37,0.61 22.45,1.52 R919.P$1 20.52,1.63 20.52,2.95 19.41,4.06 D3.2 | C609.P$1 v7.73,33.11 v7.72,33.12
  Top 0.61: v23.37,7.21 v23.88,6.71 | C601.P$2 C605.P$2 | C9.2 C8.2 9.17,11.71 9.14,11.68 9.55,11.68 v9.75,11.89 | 10.67,23.37 10.67,23.67 | 10.67,23.67 v10.87,23.88 | 10.67,23.67 10.46,23.67 v10.26,23.88 9.78,23.88 C1.2 | 45.72,28.14 v43.69,28.14 | v14.83,13.72 14.73,13.72 v14.33,14.12 | 43.78,6.71 44.2,6.71 44.91,7.42 44.91,9.45 44.6,9.75 | 22.96,32.61 22.96,31.39 v22.56,30.99 v21.95,30.99
  Ground 0.406: v43.79,6.71 43.69,6.71 | v28.55,28.55 28.75,28.55
  Bottom 0.254: L202.P$3 25.81,5.49 26.27,5.02 J202.P$6 | L202.P$4 24.38,5.49 v24.18,5.28 | v42.06,11.28 42.37,11.58 42.88,11.58 | R603.P$1 10.97,13.61 v9.65,14.93 | L203.P$3 12.55,5.46 12.55,5.38 | L201.P$4 37.35,2.16 37.29,2.16 | L5.P$4 44.05,9.76 43.75,9.76 L5.P$5 | L403.P$3 33.25,29.56 33.25,29.86 L403.P$5 33.25,29.96 33.25,30.26 L403.P$4 | L402.P$3 37.05,23.96 36.98,23.96 | L402.P$4 37.05,24.76 37.15,24.66 37.05,24.56 L402.P$5 | C6.P$2 11.95,18.76 11.95,19.96 12.05,20.06 U$15.22
  Bottom 0.305: L201.P$5 37.29,2.16 L201.P$4 37.29,1.41 U$201.A | L201.P$3 37.29,3.38 J201.P$6 | L7.P$3 18.49,29.46 18.39,29.36 18.39,29.84 J3.P$4 | L7.P$4 20.63,29.46 U$7.A | U$4.A U$401.A 43.88,19 43.28,19 43.08,19.2 L4.P$4 | v24.18,5.28 U$202.A | L203.P$4 11.38,5.38 11.08,5.68 U$203.A | L1.P$EP 10.77,23.98 v10.87,23.88
  Bottom 0.406: L203.P$4 L203.P$5 L203.P$3 12.55,5.38 13.02,5.38 13.31,5.09 | 13.31,5.09 J203.P$6 | L5.P$3 43.08,9.75 42.88,9.96 42.88,11.58 43.44,11.58 J2.P$4 | L4.P$3 43.08,21.68 J401.P$4 | U$404.A 22.16,29.57 21.84,29.26 20.84,29.26 U$7.A | 29.06,29.57 29.06,29.84 J405.P$4 29.1,28.9 28.75,28.55 v28.55,28.55 | 13.31,5.09 13.31,6.2 13.61,6.5 14.63,6.5 14.83,6.71 14.83,7.92 15.04,8.13 L3.P$EP | v39.52,28.75 39.67,28.9 J302.P$4 | U$203.A 9.85,5.68 9.65,5.49 9.65,4.67 8.94,3.96 JP5.2 | 36.58,23.27 36.98,23.67 36.98,23.96 L402.P$3 L402.P$5 | S601.B3 7.5,33.34 v7.72,33.12
  Bottom 0.61: J403.P$7 33.43,23.47 35.86,23.47 36.07,23.27 36.58,23.27
  other vias: 15.54,17.58 9.65,18.19 9.55,21.74 9.55,21.13 9.55,19.51 9.14,11.58 9.65,17.58 44.3,28.14
  pour Ground (no thermals): -9.25,-2.72 arc90 -9.23,-2.74
  pour Top: 8.43,23.27 9.65,23.27 9.96,23.57 10.57,23.57 10.67,23.47 10.67,23.06 10.36,22.76 10.16,22.76 8.64,23.06
  pour Top (no thermals): 13.31,11.68 13.31,16.05 14.22,16.97 14.22,17.48 14.33,17.58 15.54,17.58 15.65,17.48 15.65,11.68 15.75,11.58 13.41,11.58
  pour Top: 13.31,21.34 13.72,21.34 14.12,20.93 17.58,20.93 17.58,20.02 13.31,20.02
  pour Ground (no thermals): 9.86,0.2 9.86,5.59 7.92,7.52 7.92,29.06 6.3,30.68 6.3,34.44 6.71,34.85 42.57,34.75 42.57,31.39 45.01,28.96 48.46,28.96 48.46,5.79 44.81,5.79 42.77,3.76 42.77,0.3 42.57,0.1 9.96,0.1
  pour Ground: 9.86,0.3 6.91,0.3 6.1,1.12 6.1,5.08 5.49,5.69 5.28,5.89 0.71,5.89 0.2,6.4 0.2,28.85 0.71,29.36 7.72,29.36 8.03,29.06 8.03,7.52 9.86,5.69
  pour Top: 8.13,9.25 9.86,9.25 10.16,9.55 10.16,19.51 9.86,19.81 9.86,22.05 10.97,23.16 10.97,25.5 10.67,25.81 8.84,25.81 8.13,25.1
GPIO_EXT_1  (1 unrouted)
GYRO_DRDY  (via drill 0.3)  (1 unrouted)
  Top 0.305: U$2.9 42.25,6.01 v42.37,5.89
N$1  (1 unrouted)
  Top 0.245: U101.13 22.86,9.85 22.86,9.65 23.67,8.84 23.67,8.64 23.42,8.38 C103.P$2
N$2
  Top 0.245: U101.12 22.45,10.16 22.45,9.35 22.25,9.14 22.25,8.84 C102.P$1 | 22.51,8.69 C102.P$1 | C102.P$1 22.05,8.33 22.05,7.72 20.42,6.1 20.22,6.1 19.58,6.73 X101.3
N$4
  Bottom 0.2: 42.16,15.75 42.47,16.05 42.77,16.05
  Bottom 0.254: J2.P$2 42.35,14.14 42.16,14.33 42.16,15.75 | 42.77,16.05 42.98,16.26 42.98,18.49 42.47,19 42.47,19.3 42.19,19.58 L6.P$15
N$6
  Top 0.406: D3.1 16.66,4.03 R922.P$1 R918.P$2
N$7
  Top 0.254: R711.P$2 44.81,17.68 45.01,17.88 LED704.C
N$8
  Top 0.254: C613.P$1 32.11,27.08 32.11,26.17 U101.73
N$10
  Top 0.254: 16.51,19.41 13.72,19.41 13.41,19.1 12.63,19.1 U$15.14
  pour Top (no thermals): 12.6,19.51 14.33,19.51 14.53,19.71 17.58,19.71 17.58,18.8 12.6,18.8
N$11
  Top 0.254: U$605.6 17.13,15.19 17.48,15.54 C602.P$2
N$12
  Top 0.254: 39.52,13.61 39.48,13.61 U101.49
  Top 0.305: C611.P$1 40.23,13.61 39.52,13.61
N$13
  Top 0.254: R3.P$1 42.88,18.8 42.37,18.29 42.37,17.38 R707.P$2
N$15
  Bottom 0.2: L1.P$9 9.53,24.77 9.45,24.69 9.45,23.67 8.94,23.16 8.94,16.36 8.64,16.05 8.64,14.22 8.23,13.82 8.23,12.5 7.92,12.19 7.92,11.58 J1.S8
N$16
  Bottom 0.2: J1.S7 8.23,14.43 8.23,16.15 8.53,16.46 8.53,23.37 9.04,23.88 9.04,25.09 9.14,25.2 9.65,25.2 9.72,25.27 L1.P$10
N$17
  Top 0.254: U$15.1 13.97,22.1 14.43,21.64 15.9,21.64 U$16.2
  pour Top (no thermals): 12.6,21.84 13.51,21.84 13.72,21.64 17.58,21.64 17.58,22.45 12.7,22.45 12.6,22.35
N$18  (via drill 0.3)
  Horizontal 0.61: U$14.1 9.86,7.11 11.07,5.89 11.07,4.37 11.58,3.86 15.44,3.86 16.66,5.08 16.66,6.4 v16.46,6.6
  Bottom 0.254: L3.P$14 16.52,6.67 v16.46,6.6 16.56,6.71 16.97,6.71 17.02,6.76 L3.P$13
N$20
  Bottom 0.2: 41.66,13.61 41.66,17.07
  Bottom 0.254: J2.P$3 42.08,12.89 41.86,13.11 41.86,13.41 41.66,13.61 | L6.P$16 41.88,19.08 42.06,18.9 42.06,18.59 42.57,18.08 42.57,17.58 42.47,17.47 42.06,17.47 41.66,17.07
N$21
  Bottom 0.305: U$4.C 43.89,16.46
  Bottom 0.406: L5.P$2 47.03,10.55 47.35,10.87 47.35,16.15 47.04,16.46 43.89,16.46 43.69,16.46 43.48,16.26 43.48,15.4 J2.P$1
N$22
  Top 0.254: R409.P$2 SJ1.1
N$26  (1 unrouted)
N$27  (via drill 0.3)  (1 unrouted)
  Top 0.254: U$15.10 10.21,19.15 v9.96,18.9
  Bottom 0.254: v9.96,18.9 10.16,19.1
N$28
  Bottom 0.406: U$7.C L7.P$2 19.71,31.09 18.39,32.41 15.54,32.41 14.69,31.55 J3.P$1
N$29
  Top 0.254: SJ2.1 R4.P$2
N$33
  Bottom 0.254: L6.P$9 41.44,23.05 42.16,23.77 42.16,24.38 42.37,24.59 43.48,24.59 J401.P$2
  Bottom 0.406: J401.P$2 43.48,24.59
N$34
  Top 0.254: U$604.7 16.51,12.75 R606.P$1
N$36
  Bottom 0.2: J1.S6 8.13,16.87 8.13,23.57 8.64,24.08 8.64,25.4 8.84,25.6 9.45,25.6 9.61,25.77 L1.P$11
N$37
  Bottom 0.254: L6.P$10 41.99,22.08 42.16,22.25 42.16,23.16 42.27,23.27 43.41,23.27 J401.P$3
N$41
  Bottom 0.406: L402.P$2 34.85,24.38 34.34,24.89 34.34,27.03 34.14,27.23 25.2,27.23 24.99,27.03 24.99,23.98 25.49,23.48 J403.P$1
N$42
  Bottom 0.305: L4.P$2 43.89,20.92 U$401.C
  Bottom 0.406: L4.P$2 47.65,20.93 48.06,21.34 48.06,26.52 47.75,26.82 43.89,26.82 43.48,26.42 J401.P$1
N$48
  Bottom 0.406: L403.P$2 30.58,29.87 30.28,30.17 30.28,32 29.87,32.41 25.6,32.41 25.3,32.11 25.3,29.94 J405.P$1 25.34,29.87 24.28,29.87 24.08,30.07 U$404.C
N$57  (via drill 0.3)
  Top 0.305: R710.P$1 v18.8,26.82
  Bottom 0.305: v18.8,26.82 J802.P$2
N$68  (via drill 0.3)
  Vertical 0.254: J1.S5 8.64,19.91 8.64,25.91 v9.04,26.31
  Bottom 0.2: v9.04,26.31 9.09,26.27 L1.P$12
N$77  (via drill 0.3)
  Vertical 0.254: J1.S4 7.26,20.57 8.13,21.44 8.13,26.31 v8.84,27.03
  Bottom 0.2: v8.84,27.03 9.14,27.03 9.4,26.77 L1.P$13
N$78
  Bottom 0.2: J1.S3 8.13,24.49 8.13,27.03 8.33,27.23 8.33,27.43 8.53,27.63 9.04,27.63 9.41,27.27 L1.P$14
N$79
  Bottom 0.2: J1.S2 7.62,26.52 7.62,27.13 7.96,27.46 7.96,27.97 8.03,28.04 9.14,28.04 9.42,27.77 L1.P$15
N$104
  Top 0.254: U$1002.6 44.45,13.16 44.4,13.11 C1002.P$1
OTG_DM1  (via drill 0.3)
  Top 0.254: U$5.3 38.3,28.86 v38.4,28.75
  Bottom 0.254: v38.4,28.75 38.4,29.87 J302.P$3
OTG_DP1  (via drill 0.3)  (1 unrouted)
  Top 0.254: U$5.1 37.3,28.86 v37.19,28.75
  Bottom 0.254: v37.19,28.75 37.19,29.87
OTG_FS_DM
  Top 0.254: U$5.4 38.3,32.2 37.9,31.8 36.98,31.8 36.78,32 34.95,32 34.34,31.39 34.34,26.29 U101.70
OTG_FS_DP
  Top 0.254: U$5.6 34.61,32.48 33.83,31.7 33.83,26.48 U101.71
PB2-BOOT1
  Top 0.254: U101.37 R102.P$1 | R102.P$1
PPM_INPUT  (via drill 0.3)  (1 unrouted)
  Bottom 0.254: L3.P$3 16.52,9.18 v16.05,9.65
REGD
  Top 0.254: U$2.13 42.88,8.01 C5.P$1
SAFETY  (via drill 0.3)
  Top 0.305: R713.P$1 17.48,26.72 v17.58,26.82
  Bottom 0.305: v17.58,26.82 17.58,25.62 J802.P$3
SDIO_CK  (via drill 0.3)  (1 unrouted)
  Top 0.305: v40.84,26.52 40.84,25.98 U$3.6
SDIO_CMD  (via drill 0.3)  (1 unrouted)
  Top 0.305: U$3.1 47.2,23.42 v47.24,23.47
SDIO_D0  (1 unrouted)
SDIO_D1  (via drill 0.3)  (1 unrouted)
  Top 0.305: U$3.2 v47.24,24.69
SDIO_D2  (via drill 0.3)  (1 unrouted)
  Top 0.305: U$3.3 47.2,25.96 v47.24,26.01
SDIO_D3  (via drill 0.3)  (1 unrouted)
  Top 0.305: v40.84,25.2 40.84,24.71 U$3.7
SERIAL1_CTS  (1 unrouted)
SERIAL1_RTS  (1 unrouted)
SERIAL1_RX  (1 unrouted)
SERIAL1_TX  (1 unrouted)
SERIAL2_CTS
  Bottom 0.254: L2.P$15 27.46,7.69 27.64,7.52 27.64,6.81 28.14,6.3 28.65,6.3 28.85,6.1 28.85,5.03 J202.P$4
SERIAL2_RTS
  Bottom 0.254: L2.P$16 27.01,6.72 27.53,6.2 27.53,5.08 J202.P$5
SERIAL2_RX
  Bottom 0.254: L2.P$14 27.57,8.19 28.04,7.72 28.04,7.01 28.24,6.81 28.85,6.81 29.46,6.2 29.87,6.2 30.07,5.99 30.07,5.04 J202.P$3
SERIAL2_TX
  Bottom 0.254: L2.P$13 27.68,8.69 28.45,7.92 28.45,7.31 28.55,7.21 29.06,7.21 29.67,6.6 30.18,6.6 30.58,6.2 31.29,6.2 31.39,6.1 31.39,5.07 J202.P$2
SERIAL3_RX
  Bottom 0.2: L3.P$12 17.52,6.65 17.07,6.2 17.07,5.08 J203.P$3
SERIAL3_TX
  Bottom 0.2: L3.P$11 18.02,6.46 18.39,6.1 18.39,5.12 J203.P$2
SPEKTRUM_RX  (via drill 0.3)  (1 unrouted)
  Bottom 0.254: L3.P$4 17.02,9.5 v16.87,9.65
SPI_EXT_MISO  (1 unrouted)
SPI_EXT_MOSI  (1 unrouted)
SPI_EXT_SCK  (1 unrouted)
SPI_INT_MISO  (1 unrouted)
SPI_INT_MOSI  (1 unrouted)
SPI_INT_SCK  (1 unrouted)
  Top 0.254: U$2.4 38.67,6.5
V_EXT
  Top 0.406: R922.P$2 16.66,1.12 16.36,0.81 12.6,0.81 12.29,1.12 12.29,1.73 11.89,2.13 D5.A
  Top 1.016: D5.A 9.35,2.13 8.64,1.42 JP5.1
V_SERVO
  Top 0.406: 8.53,6.5 8.23,6.81 8.23,7.72 7.21,8.74 5.59,8.74 4.22,10.11 J1.PWR_S8
  Top 0.813: D2.A 9.45,5.59 8.53,6.5
  pour Top (no thermals): 9.45,5.18 6.2,5.18 5.28,5.99 5.28,7.32 3.86,8.74 3.86,9.75 4.27,10.16 5.08,10.16 5.99,9.14 7.11,9.14 9.45,6.81
  pour Top (no thermals): 3.05,29.16 5.59,29.16 5.59,9.96 4.88,9.25 3.56,9.25 3.15,9.65 3.05,9.75
VBAT  (1 unrouted)
VBUS  (via drill 0.3)
  Top 0.254: U$5.5 37.8,33.32 v37.39,33.73 | U101.68 33.73,24.26 33.73,24.89 34.85,26.01 34.85,29.67 v35.05,29.87
  Top 0.61: D1.ANODE 36.13,31.19 35.36,31.19 35.05,30.89 v35.05,29.87
  Bottom 0.406: v37.39,33.73 34.95,33.73 34.85,33.63 34.85,30.07 v35.05,29.87 35.91,29.87 J302.P$1
  Bottom 0.61: v35.05,30.48 v35.05,29.87
VDD_3V3_PERIPH
  Top 0.254: U$1002.7 44.95,13.16 45.11,13
  Top 0.406: 45.11,13 45.21,12.9 45.21,12.6 45.52,12.29 C1004.P$1
VDD_3V3_PERIPH_EN
  Top 0.254: R5.P$2 U$1002.4
VDD_3V3_SENSORS
  Top 0.254: U$2.1 38.71,8.04 38.71,8.84 39.01,9.14 40.03,9.14 | 40.03,9.14 40.34,9.14 40.44,9.04 40.53,8.95 U$2.14 | U$2.15 40.03,9.14
  Top 0.305: U$1002.8 46.69,13.53 C1003.P$1 46.74,13.11 46.84,13 46.84,11.58 46.74,11.48 46.74,10.87 46.43,10.57 43.08,10.57 42.67,10.16 C506.P$1
  Top 0.406: C506.P$1 40.47,9.08 40.44,9.04 | C505.P$1 41.45,9.45 41.15,9.14 40.73,9.14 40.53,8.95
VDD_3V3_SENSORS_EN  (1 unrouted)
  Top 0.254: U$1002.5 43.95,13.17 43.79,13 43.18,13 R1002.P$2
VDD_3V3_SPEKTRUM  (via drill 0.3)
  Top 0.305: U$605.8 15.54,16.56
  Top 0.406: 15.54,16.56 15.75,16.76 16.56,16.76 16.97,17.17 16.97,17.47 | C605.P$1 17.07,17.58 16.97,17.47 | 16.97,17.47 16.87,17.37 v16.87,16.87
  Top 0.61: C605.P$1 v18.29,17.58
  Horizontal 0.61: 17.68,17.58 v18.29,17.58 | v10.77,16.87 v10.26,16.36
  Horizontal 0.813: v10.77,16.87 12.5,16.87 13.21,16.15 16.26,16.15 16.87,16.76 | 16.87,16.76 v16.87,16.87 | 16.87,16.76 17.68,17.58
  Vertical 0.813: U$14.2 5.84,8.74 7.52,8.74 7.82,8.43 8.84,8.43 9.25,8.84 9.25,10.36 9.75,10.87 10.97,10.87 11.18,11.07 11.18,16.46 v10.77,16.87
  Power 0.61: U$14.2 5.74,8.64 8.84,8.64 9.25,9.04 9.25,10.26 8.33,11.18 8.33,15.14 9.55,16.36 v10.26,16.36 v10.77,16.87
VDD_3V3_SPEKTRUM_EN  (via drill 0.3)
  Top 0.254: U$605.5 15.54,14.68 v15.54,14.12
  Bottom 0.254: v15.54,14.12 14.83,14.83 13.92,14.83 13.51,14.43 13.51,13.92 13.21,13.61 R603.P$2
VDD_5V  (via drill 0.3)  (1 unrouted)
  Top 0.254: U$605.1 13.45,16.19 13.41,16.15 13.41,17.51 C601.P$1 | U$604.1 12.41,13.25 C8.1 | U$15.13 12.08,18.19 C7.P$1 12.4,18.08 12.5,17.98 12.5,16.28 C9.1 | U$605.4 13.58,14.69 13.41,14.53 | LED701.A LED704.A 47.35,17.88 v47.85,17.37 | v12.19,11.48 12.25,11.56 12.37,11.4 | v12.6,11.99 12.45,12.06 12.37,12.22
  Top 0.305: U$1002.1 45.71,15.13 45.82,15.24 45.82,16.32 C1001.P$1
  Top 0.406: 12.37,12.22 C8.1 | 12.37,11.4 C10.1 | R607.P$1 13.72,10.67 13.31,10.26 C10.1 | 13.41,16.15 C9.1 | 13.41,14.53 v12.8,14.53 12.5,14.83 v12.19,14.83 | v12.19,11.48 12.19,11.58 v12.6,11.99 | C1001.P$1 45.96,16.26 47.45,16.26 v47.85,16.66 v47.85,17.37 | v11.28,6.81 11.07,7.01 v11.07,7.52 11.58,7.52 11.98,7.92 R609.P$2 11.98,8.83 12.09,8.94 12.29,8.94 12.29,10.19 C10.1
  Top 0.61: C9.1 C8.1
  Power 0.61: 47.5,16.31 47.5,16.61 47.85,16.97 v47.85,17.37
  Power 0.813: 47.5,16.31 47.35,16.15 47.35,8.13 45.01,5.79 44.4,5.79 42.57,3.96 42.57,1.63 41.86,0.91 13.11,0.91 11.07,2.95 v11.07,7.52
VDD_5V_PERIPH  (via drill 0.3)  (1 unrouted)
  Top 0.254: v16.87,13.61 16.5,13.25 U$604.8 15.68,13.34 16.05,13.72 v16.26,13.72
  Top 0.305: v17.37,13.11 16.76,13.72 v16.26,13.72
  Power 0.61: 12.4,6.81 v12.4,7.42 | 16.56,12.9 16.56,13.41 v16.26,13.72
  Power 0.813: 14.02,5.18 15.34,5.18 | 15.34,5.18 20.73,5.18 v21.84,4.06 v22.45,4.06 v36.07,4.06 | v35.46,4.06 v36.07,4.06 | v44.09,8.23 38.1,8.23 37.8,7.92 37.8,4.57 37.29,4.06 v36.07,4.06 | 15.34,5.18 15.34,7.92 14.12,9.14 14.12,10.26 14.94,11.07 16.15,11.07 16.56,11.48 16.56,12.9
  Power 1.016: v19.1,28.55 18.69,28.96 18.69,31.5 19.81,32.61 31.29,32.61 32.92,30.99 v33.22,30.99 | 14.02,5.18 12.4,6.81
  Bottom 0.254: v37.8,24.99 37.85,25.06 37.78,25.06
  Bottom 0.406: L201.P$1 36.49,3.03 36.37,3.15 36.37,3.76 v36.07,4.06 v35.46,4.06 | L203.P$1 v12.09,6.81 | L202.P$1 24.57,6.29 24.38,6.1 24.08,6.1 23.67,5.69 22.76,5.69 22.45,5.38 v22.45,4.06 v21.84,4.06 | L5.P$1 43.69,8.43 43.89,8.23 v44.09,8.23 | v42.16,21.54 42.28,21.42 L4.P$1 42.27,20.32 v42.47,20.12 | v37.8,25.6 37.78,25.6 37.78,25.06 L402.P$1 | v19.1,28.55 19.22,28.66 L7.P$1 20.21,28.66 v20.32,28.55 | L403.P$1 34.02,30.8 33.83,30.99 v32.51,30.99
  Bottom 0.61: v12.8,6.81 12.4,7.21 | 12.4,7.21 v12.4,7.42 | 12.4,7.21 12.09,6.91 v12.09,6.81
  pour Power (no thermals): 15.24,12.8 17.88,12.8 17.88,18.39 21.84,22.35 22.45,22.35 27.33,27.23 27.33,28.24 27.53,28.45 29.87,28.45 32.31,26.01 38.81,26.01 39.62,24.99 39.62,21.44 41.55,19.51 43.69,19.51 43.69,26.62 41.55,28.75 41.55,31.39 40.44,32.51 32.51,32.51 31.9,31.9 31.9,31.39 32.72,30.58 34.75,30.58 35.97,29.36 37.69,29.36 37.9,29.16 37.9,28.65 38.2,28.35 38.2,27.74 37.8,27.33 34.95,27.33 34.04,28.24 32.51,28.24 30.48,30.28 26.01,30.28 25.1,29.36 24.59,29.36 18.8,23.57 17.58,23.57 17.37,23.37 17.37,22.15 15.95,20.73 15.95,16.46 14.83,15.34 14.83,13.21
VDD_5V_SENS  (via drill 0.3)  (1 unrouted)
  Top 0.406: R609.P$1 10.46,8.33 | 10.46,8.33 R610.P$1 | v10.46,9.14 10.46,8.33
VDD_IN  (via drill 0.3)
  Top 0.2: U$15.2
  Top 0.254: U$15.3 11.58,24.08 11.79,24.28 11.89,24.28 | 11.89,24.28 C1.1 12.6,24.26 12.6,23.77 12.6,23.16 12.08,22.65 U$15.2 | C12.P$1 11.47,24.7 11.89,24.28
  Top 0.406: v13.82,8.03 13.51,7.72 v13.51,7.42
  Top 0.61: 13.51,23.77 13.72,23.98 v13.72,24.18 | 13.51,23.57 v13.41,23.57 13.41,23.16 v13.21,22.96 | D1.CATHODE v36.17,27.94 v36.78,27.94 v37.39,27.94
  Top 0.813: D2.C 14.95,6.89 v13.82,8.03 | v13.41,23.57 13.41,23.67 12.7,23.67 12.6,23.77
  Top 1.016: D5.C D2.C
  Power 0.61: v13.72,24.18 13.72,23.88 v13.41,23.57 13.21,23.37 v13.21,22.96 | v36.17,27.94 v37.39,27.94 35.36,27.94
  Power 0.813: v13.82,8.03 11.18,10.67 11.07,10.67 | v13.51,7.42 v14.12,7.42 | 24.89,31.09 30.89,31.09 30.89,30.99 32.92,28.96 34.34,28.96 35.36,27.94
  Power 1.016: 24.89,31.09 18.08,24.28 16.46,24.28 15.85,23.67 15.04,23.67
  Power 1.27: 11.07,10.67 11.07,15.54 11.79,16.26 12.4,16.26 15.04,18.9 15.04,23.67 13.41,23.67 v13.41,23.57
VDD_SERVO_SENS
  Top 0.406: R919.P$2 17.99,1.52 R918.P$1

## Text on the board
tPlace: PX4FMULite V0.x
bPlace: SAFETY | FMU B/E | CAN2 | CAN1 | USB | ADC | SER1 | SPKT | AUX ADC | I2C1 | POWER | SER2 | SER4 | I2C2 | SPI | UART1 | Y | Z | X | UART3 / GPS | UART2 | AIR | SER3
Document: Optimized for good / manual soldering / accessibility